# EAGLE design receevur (EAGLE 9.2.2)
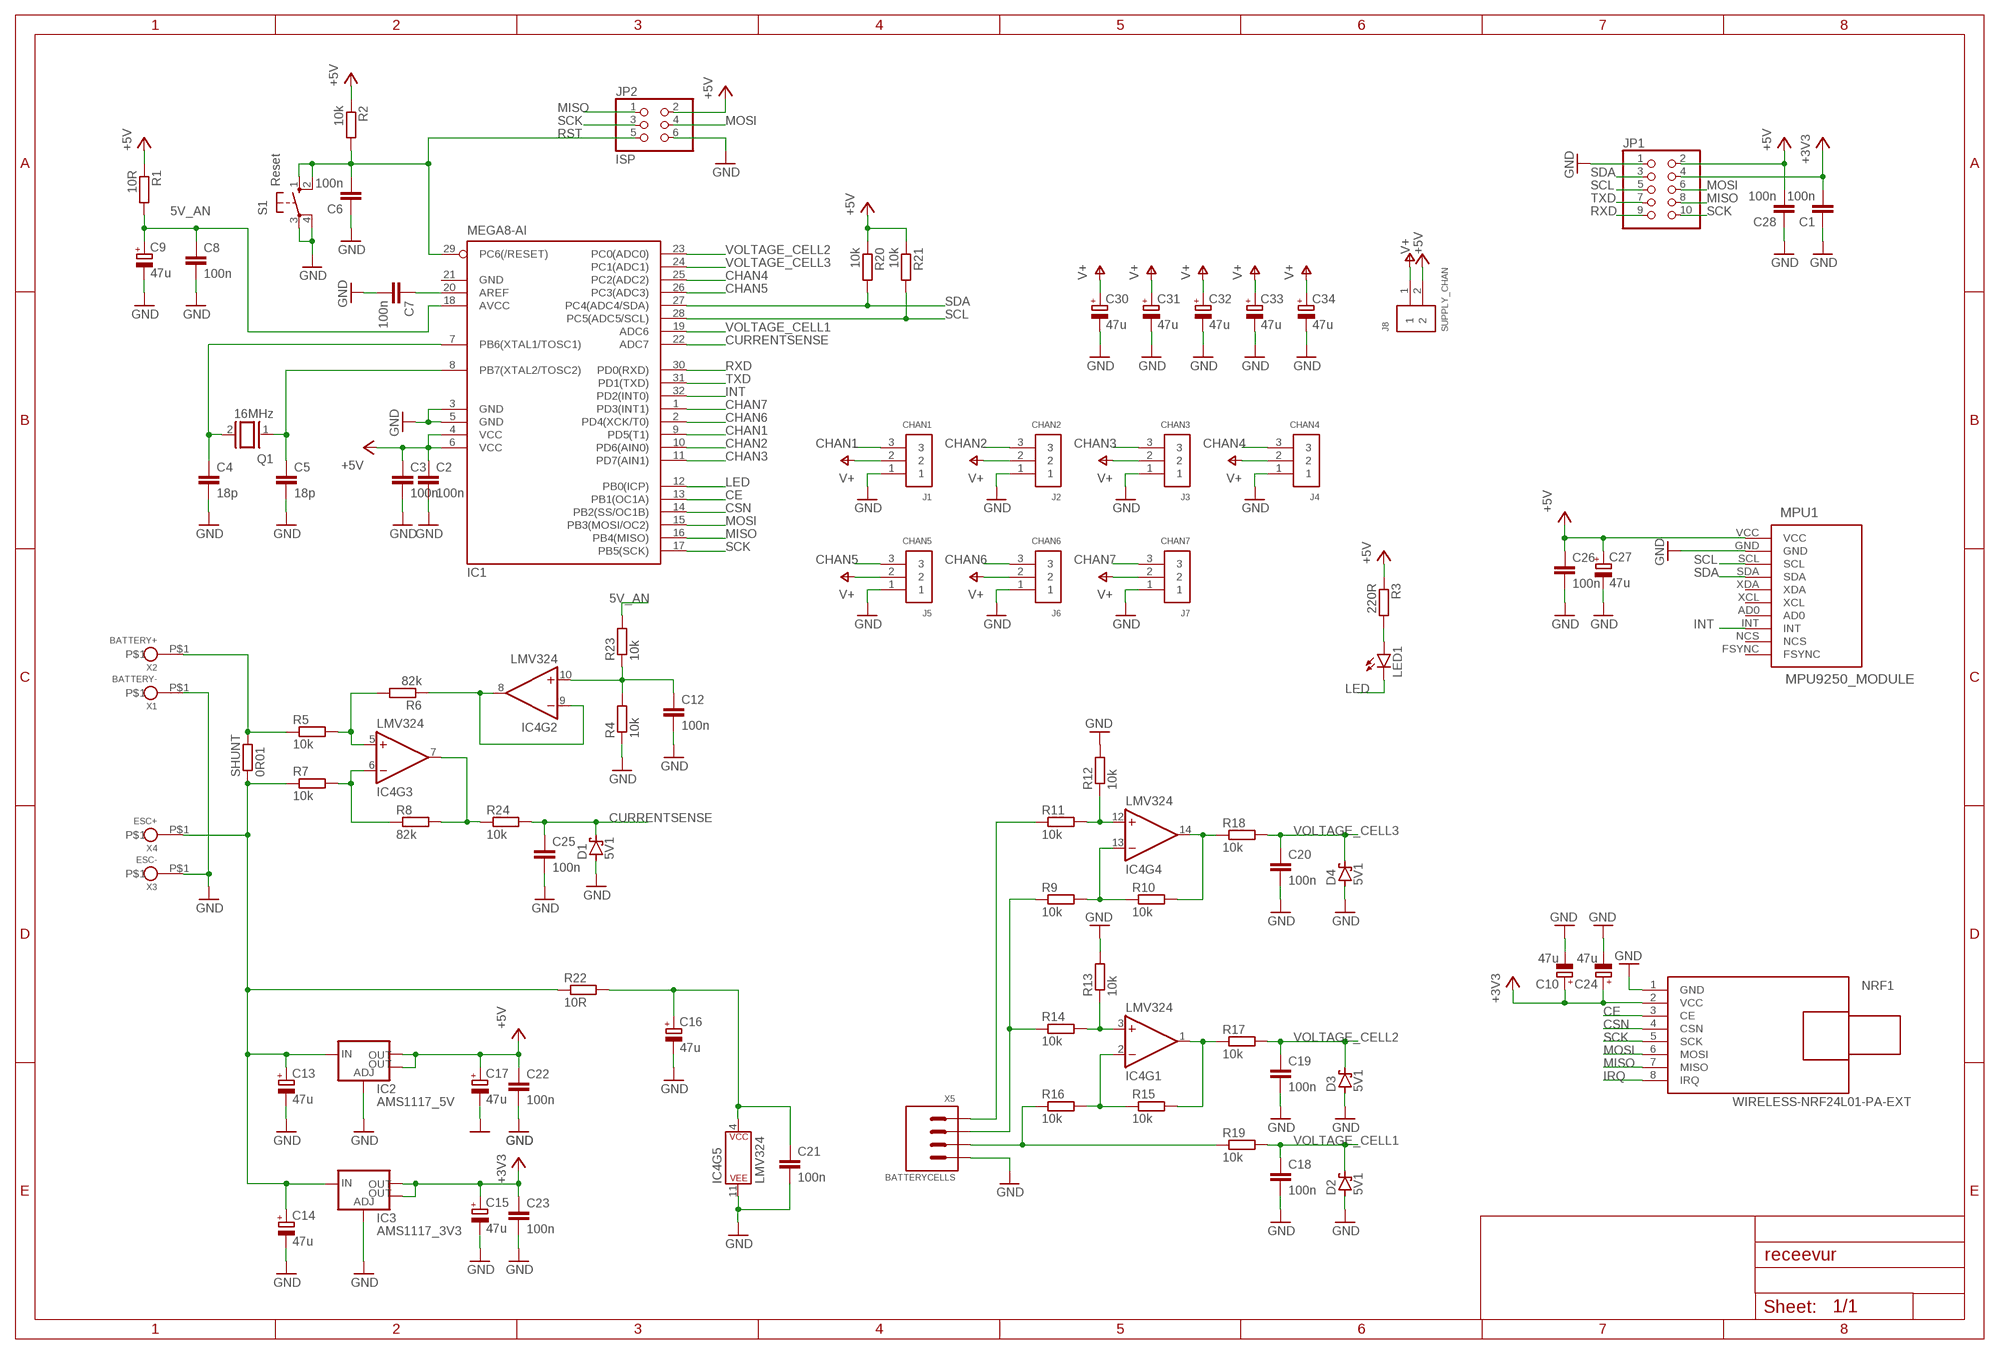
[diagram p0: schematic, sheet 1]

## Parts
C1  100n  C-EUC0805  [C0805]
C2  100n  C-EUC0805  [C0805]
C3  100n  C-EUC0805  [C0805]
C4  18p  C-EUC0805  [C0805]
C5  18p  C-EUC0805  [C0805]
C6  100n  C-EUC0805  [C0805]
C7  100n  C-EUC0805  [C0805]
C8  100n  C-EUC0805  [C0805]
C9  47u  CPOL-EU153CLV-0405  [153CLV-0405]
C10  47u  CPOL-EU153CLV-0405  [153CLV-0405]
C12  100n  C-EUC0805  [C0805]
C13  47u  CPOL-EU153CLV-0405  [153CLV-0405]
C14  47u  CPOL-EU153CLV-0405  [153CLV-0405]
C15  47u  CPOL-EU153CLV-0405  [153CLV-0405]
C16  47u  CPOL-EU153CLV-0405  [153CLV-0405]
C17  47u  CPOL-EU153CLV-0405  [153CLV-0405]
C18  100n  C-EUC0805  [C0805]
C19  100n  C-EUC0805  [C0805]
C20  100n  C-EUC0805  [C0805]
C21  100n  C-EUC0805  [C0805]
C22  100n  C-EUC0805  [C0805]
C23  100n  C-EUC0805  [C0805]
C24  47u  CPOL-EU153CLV-0405  [153CLV-0405]
C25  100n  C-EUC0805  [C0805]
C26  100n  C-EUC0805  [C0805]
C27  47u  CPOL-EU153CLV-0405  [153CLV-0405]
C28  100n  C-EUC0805  [C0805]
C30  47u  CPOL-EU153CLV-0405  [153CLV-0405]
C31  47u  CPOL-EU153CLV-0405  [153CLV-0405]
C32  47u  CPOL-EU153CLV-0405  [153CLV-0405]
C33  47u  CPOL-EU153CLV-0405  [153CLV-0405]
C34  47u  CPOL-EU153CLV-0405  [153CLV-0405]
D1  5V1  BAT60J  [SOD323_ST]
D2  5V1  BAT60J  [SOD323_ST]
D3  5V1  BAT60J  [SOD323_ST]
D4  5V1  BAT60J  [SOD323_ST]
IC1  MEGA8-AI  [TQFP32-08]
IC2  AMS1117_5V  V_REG_LM1117SOT223  [SOT223]
IC3  AMS1117_3V3  V_REG_LM1117SOT223  [SOT223]
IC4  LMV324  [SO14]
J1  CHAN1  61300311121  [61300311121]
J2  CHAN2  61300311121  [61300311121]
J3  CHAN3  61300311121  [61300311121]
J4  CHAN4  61300311121  [61300311121]
J5  CHAN5  61300311121  [61300311121]
J6  CHAN6  61300311121  [61300311121]
J7  CHAN7  61300311121  [61300311121]
J8  SUPPLY_CHAN  61300211121  [61300211121]
JP1  PINHD-2X5  [2X05]
JP2  ISP  PINHD-2X3  [2X03]
LED1  LEDCHIP-LED0805  [CHIP-LED0805]
MPU1  MPU9250_MODULE  [MPU9250_MODULE]
NRF1  WIRELESS-NRF24L01-PA-EXT  [WIRELESS-NRF24L01-PA-EXT]
Q1  16MHz  XTAL/S  [QS]
R1  10R  R-EU_R0805  [R0805]
R2  10k  R-EU_R0805  [R0805]
R3  220R  R-EU_R0805  [R0805]
R4  10k  R-EU_R0805  [R0805]
R5  10k  R-EU_R0805  [R0805]
R6  82k  R-EU_R0805  [R0805]
R7  10k  R-EU_R0805  [R0805]
R8  82k  R-EU_R0805  [R0805]
R9  10k  R-EU_R0805  [R0805]
R10  10k  R-EU_R0805  [R0805]
R11  10k  R-EU_R0805  [R0805]
R12  10k  R-EU_R0805  [R0805]
R13  10k  R-EU_R0805  [R0805]
R14  10k  R-EU_R0805  [R0805]
R15  10k  R-EU_R0805  [R0805]
R16  10k  R-EU_R0805  [R0805]
R17  10k  R-EU_R0805  [R0805]
R18  10k  R-EU_R0805  [R0805]
R19  10k  R-EU_R0805  [R0805]
R20  10k  R-EU_R0805  [R0805]
R21  10k  R-EU_R0805  [R0805]
R22  10R  R-EU_R0805  [R0805]
R23  10k  R-EU_R0805  [R0805]
R24  10k  R-EU_R0805  [R0805]
S1  Reset  10-XX  [B3F-10XX]
SHUNT  0R01  R-EU_R2512  [R2512]
X1  BATTERY-  SMDSOLDERPAD5X7MM  [SMDSOLDERPAD_5X7]
X2  BATTERY+  SMDSOLDERPAD5X7MM  [SMDSOLDERPAD_5X7]
X3  ESC-  SMDSOLDERPAD5X7MM  [SMDSOLDERPAD_5X7]
X4  ESC+  SMDSOLDERPAD5X7MM  [SMDSOLDERPAD_5X7]
X5  BATTERYCELLS  CELLJACK  [CELLJACK]

## Nets
5V_AN: C8.1 C9.+ IC1.18(AVCC) R1.2 R23.2
+3V3: C1.2 C10.+ C15.+ C23.1 C24.+ IC3.2(OUT) IC3.4(OUT) JP1.4 NRF1.2(VCC)
+5V: C2.1 C3.1 C17.+ C22.1 C26.1 C27.+ C28.2 IC1.4(VCC) IC1.6(VCC) IC2.2(OUT) IC2.4(OUT) J8.2 JP1.2 JP2.2 MPU1.VCC R1.1 R2.1 R3.1 R20.1 R21.1
CE: IC1.13(PB1(OC1A)) NRF1.3(CE)
CHAN1: IC1.9(PD5(T1)) J1.3
CHAN2: IC1.10(PD6(AIN0)) J2.3
CHAN3: IC1.11(PD7(AIN1)) J3.3
CHAN4: IC1.25(PC2(ADC2)) J4.3
CHAN5: IC1.26(PC3(ADC3)) J5.3
CHAN6: IC1.2(PD4(XCK/T0)) J6.3
CHAN7: IC1.1(PD3(INT1)) J7.3
CSN: IC1.14(PB2(SS/OC1B)) NRF1.4(CSN)
CURRENTSENSE: C25.1 D1.C IC1.22(ADC7) R24.2
GND: C1.1 C2.2 C3.2 C4.2 C5.2 C6.1 C7.2 C8.2 C9.- C10.- C12.2 C13.- C14.- C15.- C16.- C17.- C18.2 C19.2 C20.2 C21.2 C22.2 C23.2 C24.- C25.2 C26.2 C27.- C28.1 C30.- C31.- C32.- C33.- C34.- D1.A D2.A D3.A D4.A IC1.3(GND) IC1.5(GND) IC2.1(ADJ) IC3.1(ADJ) IC4.11(P$V-) J1.1 J2.1 J3.1 J4.1 J5.1 J6.1 J7.1 JP1.1 JP2.6 MPU1.GND NRF1.1(GND) R4.1 R12.2 R13.2 S1.3(P) S1.4(P1) X1.P$1 X3.P$1 X5.P$1
INT: IC1.32(PD2(INT0)) MPU1.INT
IRQ: NRF1.8(IRQ)
LED: IC1.12(PB0(ICP)) LED1.C
MISO: IC1.16(PB4(MISO)) JP1.8 JP2.1 NRF1.7(MISO)
MOSI: IC1.15(PB3(MOSI/OC2)) JP1.6 JP2.4 NRF1.6(MOSI)
N$1: C4.1 IC1.7(PB6(XTAL1/TOSC1)) Q1.2
N$2: C5.1 IC1.8(PB7(XTAL2/TOSC2)) Q1.1
N$3: C7.1 IC1.20(AREF)
N$4: LED1.A R3.2
N$5: C13.+ C14.+ IC2.3(IN) IC3.3(IN) R7.1 R22.1 SHUNT.1 X4.P$1
N$6: IC4.12(+IN) R11.2 R12.1
N$7: C16.+ C21.1 IC4.4(P$V+) R22.2
N$8: R5.1 SHUNT.2 X2.P$1
N$9: IC4.13(-IN) R9.2 R10.1
N$10: IC4.8(OUT) IC4.9(-IN) R6.1
N$12: IC4.6(-IN) R7.2 R8.1
N$18: IC4.14(OUT) R10.2 R18.1
N$19: IC4.3(+IN) R13.1 R14.2
N$20: IC4.2(-IN) R15.1 R16.2
N$21: IC4.1(OUT) R15.2 R17.1
N$22: R11.1 X5.P$4
N$23: R9.1 R14.1 X5.P$3
N$24: R16.1 R19.1 X5.P$2
N$32: C12.1 IC4.10(+IN) R4.2 R23.1
N$33: IC4.5(+IN) R5.2 R6.2
N$$$: IC4.7(OUT) R8.2 R24.1
RST: C6.2 IC1.29(PC6(/RESET)) JP2.5 R2.2 S1.1(S) S1.2(S1)
RXD: IC1.30(PD0(RXD)) JP1.9
SCK: IC1.17(PB5(SCK)) JP1.10 JP2.3 NRF1.5(SCK)
SCL: IC1.28(PC5(ADC5/SCL)) JP1.5 MPU1.SCL R21.2
SDA: IC1.27(PC4(ADC4/SDA)) JP1.3 MPU1.SDA R20.2
TXD: IC1.31(PD1(TXD)) JP1.7
V+: C30.+ C31.+ C32.+ C33.+ C34.+ J1.2 J2.2 J3.2 J4.2 J5.2 J6.2 J7.2 J8.1
VOLTAGE_CELL1: C18.1 D2.C IC1.19(ADC6) R19.2
VOLTAGE_CELL2: C19.1 D3.C IC1.23(PC0(ADC0)) R17.2
VOLTAGE_CELL3: C20.1 D4.C IC1.24(PC1(ADC1)) R18.2
Unconnected: MPU1.AD0 MPU1.FSYNC MPU1.NCS MPU1.XCL MPU1.XDA

## Power pins joined to a net without a drawn wire
GND: IC1.21(GND)

## Library data of the parts
C1-C8 C12 C18-C23 C25 C26 C28 = rcl:C-EU: CAPACITOR, European symbol; SPICEPREFIX: C
C9 C10 C13-C17 C24 C27 C30-C34 = rcl:CPOL-EU: POLARIZED CAPACITOR, European symbol; SPICEPREFIX: C
D1-D4 = diode:BAT60J: Schottky barrier diode Source: www.st.com, BAT60J.pdf
IC1 = atmel:MEGA8: MICROCONTROLLER 8 Kbytes FLASH, 1 kbytes SRAM, 512 bytes EEPROM, USART, 6-channel 10 bit ADC, 2-channel 8 bit ADC Pin compatible with Atmega48, ATMega88, ATMega168 Source: avr.lbr; MPN: ATMEGA8-16AU; OC_FARNELL: 9171371; OC_NEWARK: 73M8863
IC2 IC3 = SparkFun-IC-Power:V_REG_LM1117: Voltage Regulator LM1117 Standard adjustable voltage regulator but in SMD form. Spark Fun Electronics SKU : COM-00595; PROD_ID: VREG-08170
IC4 = SparkFun-IC-Amplifiers:LMV324: IC LMV324 Quad Op Amp Jellybean quad op-amp Datasheet <http://cdn.sparkfun.com/datasheets/Sensors/Sound/LMV324.pdf> SparkFun Products SparkFun Sensor Kit <https://www.sparkfun.com/products/13754> (DEV-13754) SparkFun Inventor's Kit for Arduino 101 <https://www.sparkfun.com/products/13844> (KIT-13844) SparkFun Sound Detector <https://www.sparkfun.com/products/12642> (SEN-12642); PROD_ID: IC-08227
J1-J7 = Headers:61300311121: CONN HEADER VERT 3POS 2.54MM Manufacturer's datasheet <https://katalog.we-online.de/em/datasheet/6130xx11121.pdf>; CREATED_BY: PCBLayout.com; DIGI_KEY_PART_NUMBER: 732-5316-ND; MANUFACTURER: Wurth Electronics Inc.; MPN: 61300311121
J8 = Headers:61300211121: CONN HEADER VERT 2POS 2.54MM Manufacturer's datasheet <https://katalog.we-online.de/em/datasheet/6130xx11121.pdf>; CREATED_BY: PCBLayout.com; DIGI_KEY_PART_NUMBER: 732-5315-ND; MANUFACTURER: Wurth Electronics Inc.; MPN: 61300211121
JP1 = pinhead:PINHD-2X5: PIN HEADER
JP2 = pinhead:PINHD-2X3: PIN HEADER
LED1 = led:LED: LED OSRAM: - CHIPLED LG R971, LG N971, LY N971, LG Q971, LY Q971, LO R971, LY R971 LH N974, LH R974 LS Q976, LO Q976, LY Q976 LO Q996 - Hyper CHIPLED LW Q18S LB Q993, LB Q99A, LB R99A - SideLED LS A670, LO A670, LY A670, LG A670, LP A670 LB A673, LV A673, LT A673, LW A673 LH A674 LY A675 LS A676, LA A676, LO A676, LY A676, LW A676 LS A679, LY A679, LG A679 - Hyper Micro SIDELED® LS Y876, LA Y876, LO Y876, LY Y876 LT Y87S - SmartLED LW L88C, LW L88S LB L89C, LB L89S, LG L890 LS L89K, LO L89K, LY L89K LS L896, LA L896, LO L896, LY L896 - TOPLED LS T670, LO T670, LY T670, LG T670, LP T670 LSG T670, LSP T670, LSY T670, LOP T670, LYG T670 LG T671, LOG T671, LSG T671 LB T673, LV T673, LT T673, LW T673 LH T674 LS T676, LA T676, LO T676, LY T676, LB T676, LH T676, LSB T676, LW T676 LB T67C, LV T67C, LT T67C, LS T67K, LO T67K, LY T67K, LW E67C LS E67B, LA E67B, LO E67B, LY E67B, LB E67C, LV E67C, LT E67C LW T67C LS T679, LY T679, LG T679 LS T770, LO T770, LY T770, LG T770, LP T770 LB T773, LV T773, LT T773, LW T773 LH T774 LS E675, LA E675, LY E675, LS T675 LS T776, LA T776, LO T776, LY T776, LB T776 LHGB T686 LT T68C, LB T68C - Hyper Mini TOPLED® LB M676 - Mini TOPLED Santana® LG M470 LS M47K, LO M47K, LY M47K Source: http://www.osram.convergy.de LUXEON: - LUMILED® LXK2-PW12-R00, LXK2-PW12-S00, LXK2-PW14-U00, LXK2-PW14-V00 LXK2-PM12-R00, LXK2-PM12-S00, LXK2-PM14-U00 LXK2-PE12-Q00, LXK2-PE12-R00, LXK2-PE12-S00, LXK2-PE14-T00, LXK2-PE14-U00 LXK2-PB12-K00, LXK2-PB12-L00, LXK2-PB12-M00, LXK2-PB14-N00, LXK2-PB14-P00, LXK2-PB14-Q00 LXK2-PR12-L00, LXK2-PR12-M00, LXK2-PR14-Q00, LXK2-PR14-R00 LXK2-PD12-Q00, LXK2-PD12-R00, LXK2-PD12-S00 LXK2-PH12-R00, LXK2-PH12-S00 LXK2-PL12-P00, LXK2-PL12-Q00, LXK2-PL12-R00 Source: www.luxeon.com KINGBRIGHT: KA-3528ASYC Source: www.kingbright.com
MPU1 = flightcontroller:MPU9250_MODULE
NRF1 = diy-modules:WIRELESS-NRF24L01-PA-EXT: 2.4 GHz Wireless Module based on NRF24L01 chip with preamplifier and external antenna Click here to find device on ebay.com <http://www.ebay.com/sch/nrf24l01+pa+lna+sma>
Q1 = special:XTAL/S: CRYSTAL
R1-R24 SHUNT = rcl:R-EU_: RESISTOR, European symbol; SPICEPREFIX: R
S1 = switch-omron:10-XX: OMRON SWITCH; MPN: B3F-1000; OC_FARNELL: 176432; OC_NEWARK: 36M3542
X1-X4 = flightcontroller:SMDSOLDERPAD: smd solderpads, various sizes
X5 = flightcontroller:CELLJACK: battery cell monitoring jack

## Board
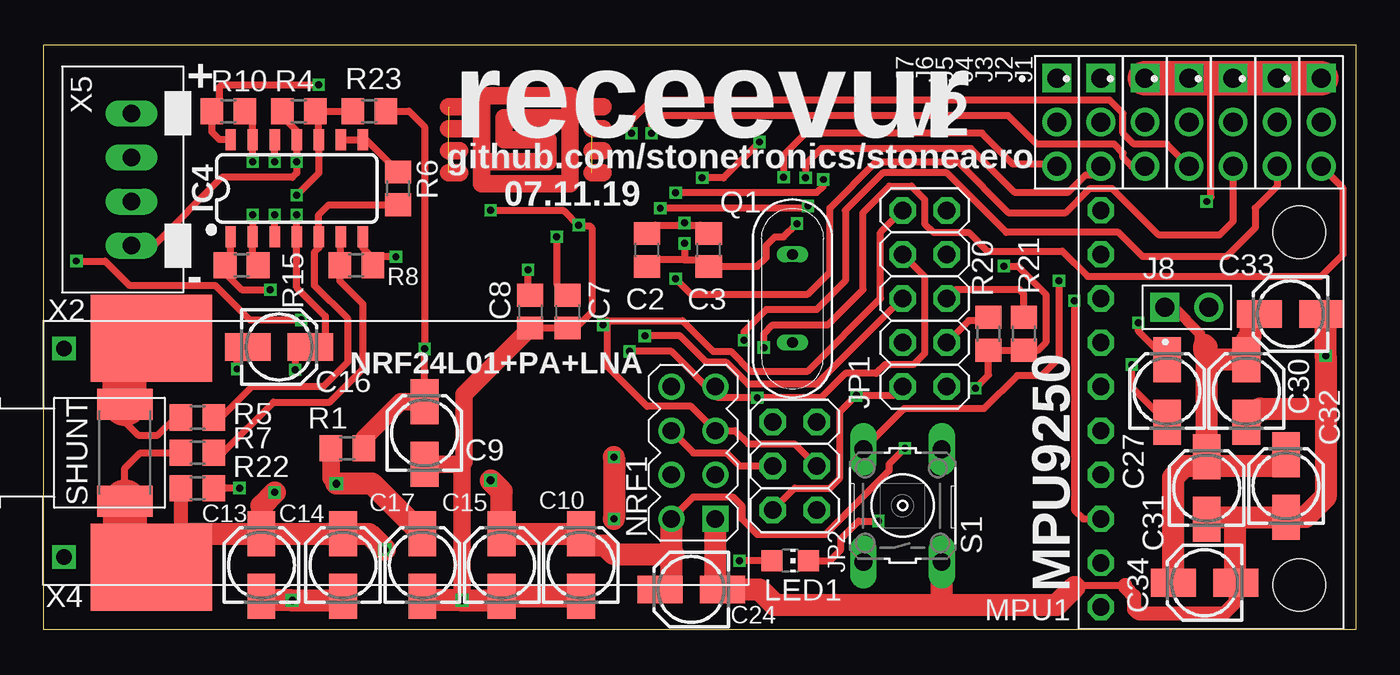
[diagram p1: board, top side]
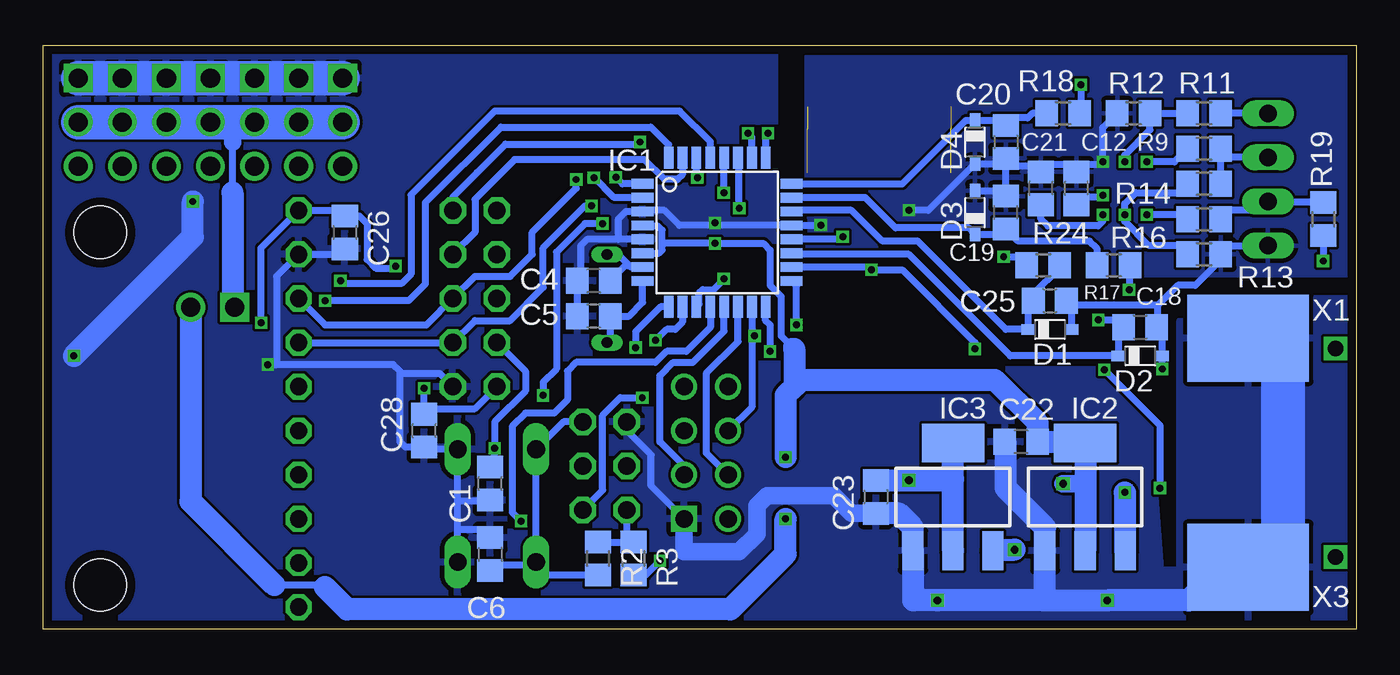
[diagram p2: board, bottom side, seen from below]

Size 75.67 x 33.65 mm. Coordinates in mm from the lower left corner, seen from the top.
Outline: 0,0 75.67,0 75.67,33.65 0,33.65 0,0
Copper layers (1*16): Top 0.035mm / dielectric 1.6mm / Bottom 0.035mm
Design rules "Elecrow_2-layer_PCB_eagle_rule": minimum track width 6mil, minimum drill 12mil, track to track 6mil, track to pad 6mil, pad to pad 6mil, via to via 8mil, smd to smd 0mil, copper to edge 20mil, drill to drill 10mil, minimum pad ring 6mil, minimum via ring 6mil, stop-mask expansion 0mil, vias tented up to drill 100mil, thermal gap 10mil

### Footprints (pad centres in the part's own frame; a part is rotated, then mirrored left to right if it is on the bottom)
C0805 = smd 1.3 x 1.5: 1 -0.95,0; 2 0.95,0
153CLV-0405 = smd 2.6 x 1.6: + 1.8,0; - -1.8,0
SOD323_ST = smd 0.8 x 0.6: A 1.25,0; C -1.25,0
TQFP32-08 = smd 1.27 x 0.559: 1 -4.293,2.8; 2 -4.293,2; 3 -4.293,1.2; 4 -4.293,0.4; 5 -4.293,-0.4; 6 -4.293,-1.2; 7 -4.293,-2; 8 -4.293,-2.8; 17 4.293,-2.8; 18 4.293,-2; 19 4.293,-1.2; 20 4.293,-0.4; 21 4.293,0.4; 22 4.293,1.2; 23 4.293,2; 24 4.293,2.8 | smd 0.559 x 1.27: 9 -2.8,-4.293; 10 -2,-4.293; 11 -1.2,-4.293; 12 -0.4,-4.293; 13 0.4,-4.293; 14 1.2,-4.293; 15 2,-4.293; 16 2.8,-4.293; 25 2.8,4.293; 26 2,4.293; 27 1.2,4.293; 28 0.4,4.293; 29 -0.4,4.293; 30 -1.2,4.293; 31 -2,4.293; 32 -2.8,4.293
SOT223 = smd 1.219 x 2.235: 1 -2.311,-3.099; 2 0,-3.099; 3 2.311,-3.099 | smd 3.6 x 2.2: 4 0,3.099
SO14 = smd 0.6 x 1.2: 1 -3.175,-2.8; 2 -1.905,-2.8; 3 -0.635,-2.8; 4 0.635,-2.8; 5 1.905,-2.8; 6 3.175,-2.8; 7 4.445,-2.8; 8 4.445,2.8; 9 3.175,2.8; 10 1.905,2.8; 11 0.635,2.8; 12 -0.635,2.8; 13 -1.905,2.8; 14 -3.175,2.8
61300311121 = drill 1.1 square: 1 -2.54,0 | drill 1.1: 2 0,0; 3 2.54,0
61300211121 = drill 1.1 square: 1 -1.27,0 | drill 1.1: 2 1.27,0
2X05 = drill 1.016 octagon: 1 -5.08,-1.27; 2 -5.08,1.27; 3 -2.54,-1.27; 4 -2.54,1.27; 5 0,-1.27; 6 0,1.27; 7 2.54,-1.27; 8 2.54,1.27; 9 5.08,-1.27; 10 5.08,1.27
2X03 = drill 1.016 octagon: 1 -2.54,-1.27; 2 -2.54,1.27; 3 0,-1.27; 4 0,1.27; 5 2.54,-1.27; 6 2.54,1.27
CHIP-LED0805 = smd 1.2 x 1.2: A 0,-1.05; C 0,1.05
MPU9250_MODULE = drill 1 octagon: AD0 0,-3.81; FSYNC 0,-11.43; GND 0,8.89; INT 0,-6.35; NCS 0,-8.89; SCL 0,6.35; SDA 0,3.81; VCC 0,11.43; XCL 0,-1.27; XDA 0,1.27 | hole 3: 11.43,10.16; 11.43,-10.16
WIRELESS-NRF24L01-PA-EXT = drill 1 square: 1 -18.415,3.81 | drill 1: 2 -15.875,3.81; 3 -18.415,1.27; 4 -15.875,1.27; 5 -18.415,-1.27; 6 -15.875,-1.27; 7 -18.415,-3.81; 8 -15.875,-3.81 | drill 0.9 square: P$1 19.125,6; P$2 19.125,-6
QS = drill 0.61 long: 1 -2.54,0; 2 2.54,0
R0805 = smd 1.3 x 1.5: 1 -0.95,0; 2 0.95,0
B3F-10XX = drill 1.016 long: 1 -3.251,2.261; 2 3.251,2.261; 3 -3.251,-2.261; 4 3.251,-2.261
R2512 = smd 1.8 x 3.2: 1 -2.8,0; 2 2.8,0
SMDSOLDERPAD_5X7 = smd 5 x 7: P$1 0,0
CELLJACK = drill 1 long: P$1 0,-3.81; P$2 0,-1.27; P$3 0,1.27; P$4 0,3.81

### Placement (x,y rotation side)
C1  49.91,8.38 90 bottom
C2  34.8,21.84 90 top
C3  38.35,21.84 90 top
C4  43.94,20.07 180 bottom
C5  43.94,18.03 180 bottom
C6  49.91,4.32 270 bottom
C7  30.23,18.29 270 top
C8  28.07,18.29 270 top
C9  21.97,11.3 90 top
C10  30.99,3.68 90 top
C12  16.13,25.4 90 bottom
C13  12.57,3.68 90 top
C14  17.27,3.68 90 top
C15  26.42,3.68 90 top
C16  13.59,16.26 0 top
C17  21.84,3.68 90 top
C18  12.45,17.4 0 bottom
C19  20.19,24 90 bottom
C20  20.19,28.07 270 bottom
C21  18.16,25.4 90 bottom
C22  19.3,10.79 180 bottom
C23  27.69,7.62 270 bottom
C24  37.34,2.29 180 top
C25  17.65,18.92 0 bottom
C26  58.29,22.86 270 bottom
C27  64.77,13.72 90 top
C28  53.72,11.43 90 bottom
C30  69.34,13.72 90 top
C31  67.06,8.13 90 top
C32  71.63,8.26 90 top
C33  71.88,18.16 180 top
C34  66.93,2.67 180 top
D1  17.65,17.27 0 bottom
D2  12.45,15.75 0 bottom
D3  21.97,24 90 bottom
D4  21.97,28.07 270 bottom
IC1  36.83,22.86 0 bottom
IC2  15.62,7.62 0 bottom
IC3  23.24,7.62 0 bottom
IC4  13.97,25.4 0 top
J1  73.66,29.21 270 top
J2  71.12,29.21 270 top
J3  68.58,29.21 270 top
J4  66.04,29.21 270 top
J5  63.5,29.21 270 top
J6  60.96,29.21 270 top
J7  58.42,29.21 270 top
J8  65.91,18.54 0 top
JP1  50.8,19.05 90 top
JP2  43.31,9.4 90 top
LED1  43.05,3.94 270 top
MPU1  60.96,12.7 0 top
NRF1  20.32,10.16 180 top
Q1  43.18,19.05 90 top
R1  17.53,10.41 0 top
R2  43.69,4.06 270 bottom
R3  41.66,4.06 270 bottom
R4  14.73,29.84 0 top
R5  8.89,12.19 0 top
R6  20.45,25.4 270 top
R7  8.89,10.16 0 top
R8  18.03,20.95 0 top
R9  8.76,27.69 180 bottom
R10  10.67,29.84 180 top
R11  8.76,29.72 180 bottom
R12  12.83,29.72 180 bottom
R13  8.76,21.59 0 bottom
R14  8.76,25.65 180 bottom
R15  11.43,20.95 180 top
R16  8.76,23.62 180 bottom
R17  13.97,20.95 180 bottom
R18  16.89,29.72 180 bottom
R19  1.91,23.62 270 bottom
R20  54.48,17.02 90 top
R21  56.52,17.02 90 top
R22  8.89,8.13 0 top
R23  18.8,29.84 0 top
R24  18.03,20.95 0 bottom
S1  49.53,7.11 90 top
SHUNT  4.7,10.16 90 top
X1  6.22,16.76 270 bottom
X2  6.22,16.76 90 top
X3  6.22,3.56 270 bottom
X4  6.22,3.56 90 top
X5  5.08,25.91 0 top

### Tracks (layer width: path | path; a pad name or v marks a point on that pad's centre or on a via)
5V_AN  (via drill 0.4)
  Top 0.406: R23.2 21.08,29.84 21.97,28.96 v21.97,16.14 C9.+ | C8.1 27.94,19.36 v27.94,20.7
  Top 1.016: R1.2 18.48,10.98 20.6,13.1 C9.+
  Bottom 0.406: IC1.18 27.94,20.86 v27.94,20.7 26.16,20.7 21.97,16.51 v21.97,16.14
+3V3  (via drill 0.4, 0.45)
  Top 0.406: NRF1.2 37.47,7.62 39.75,7.62 40.26,7.11 40.26,6.35 41.15,5.46 45.09,5.46 48.77,9.14 48.77,9.53 v49.66,10.41
  Top 1.016: NRF1.2 36.3,6.25 36.3,4.32 36.3,2.41 36.17,2.29 C24.+
  Top 1.27: v25.78,8.57 26.42,7.93 C15.+ C10.+ 31.64,4.83 32.38,4.83 32.89,4.32 36.3,4.32 | C24.+ 36.2,2.94 NRF1.2
  Bottom 0.406: JP1.4 47.88,14.86 47.88,13.72 49.66,11.94 v49.66,10.41 49.66,9.59 C1.2
  Bottom 1.27: IC3.2 23.24,8.64 | 23.24,8.64 IC3.4 | C23.1 v25.78,8.57 23.31,8.57 23.24,8.64
+5V  (via drill 0.4, 0.45)
  Top 0.406: JP2.2 43.31,8.13 45.34,8.13 45.91,8.7 45.91,12.51 v46.86,13.46 49.02,13.46 JP1.2 | v53.72,13.88 54.48,14.64 R20.1 R21.1 57.34,16.07 57.78,16.51 57.78,19.3 56.17,20.92 v55.37,20.92 | v43.43,23.37 42.67,22.61 42.16,22.61 41.66,22.1 41.66,21.4 41.15,20.89 C3.1 37.97,21.27 36.96,21.27 | C27.+ 63.12,17.17 v63.12,17.65 | C2.1 34.99,20.89 35.37,21.27 36.96,21.27 | v36.96,22.23 36.96,21.27
  Top 1.016: R1.1 16.58,8.7 v16.89,8.38
  Top 1.27: C17.+ 18.95,8.38 v16.89,8.38 | v32.89,9.91 v32.89,6.35
  Bottom 0.406: IC1.4 41.1,23.24 40.26,23.24 40.01,22.99 40.01,22.1 | 40.01,22.1 40.01,21.84 40.19,21.66 IC1.6 | R2.1 R3.1 42.04,5.39 JP2.2 | JP1.2 50.8,12.7 53.4,12.7 C28.2 v53.72,13.88 | 40.01,22.1 39.88,22.23 v36.96,22.23 34.16,22.23 33.78,21.84 33.78,19.81 33.15,19.18 33.15,16.89 32.51,16.26 | v43.43,23.37 44.45,23.37 46.1,21.72 46.1,14.99 46.86,14.22 v46.86,13.46 | v55.37,20.92 55.5,20.79 56.52,20.79 57.02,21.3 57.02,23.37 57.47,23.81 C26.1 58.61,24.13 MPU1.VCC 63.12,21.97 v63.12,17.65 | 59.44,2.41 59.56,2.54 62.36,2.54
  Bottom 1.016: 32.51,16.26 32.38,16.13 | v16.89,8.38 15.75,8.38 15.62,8.26
  Bottom 1.27: IC2.2 15.62,8.26 IC2.4 15.7,10.79 C22.1 18.35,11.88 20.83,14.35 32,14.35 32.38,13.97 | v32.89,6.35 32.89,4.32 36.07,1.14 58.17,1.14 59.44,2.41 | 62.36,2.54 67.18,7.37 J8.2 | 32.38,16.13 32.38,13.97 | v32.89,9.91 32.89,13.46 32.38,13.97
CE
  Bottom 0.406: IC1.13 36.43,17.16 38.23,15.37 39.37,15.37 40.13,14.61 40.13,10.79 38.73,9.4 NRF1.3
CHAN1  (via drill 0.4)
  Top 0.406: v41.53,16.22 41.53,17.02 42.04,17.53 45.21,17.53 47.24,19.56 47.24,24 48.77,25.53 50.04,25.53 50.8,24.77 50.8,23.37 51.31,22.86 53.34,22.86 54.42,21.78 58.74,21.78 60.2,20.32 73.66,20.32 74.93,21.59 74.93,25.4 J1.3
  Bottom 0.406: IC1.9 40.11,18.57 41.53,17.14 v41.53,16.22
CHAN2  (via drill 0.4)
  Top 0.406: J2.3 71.12,25.53 69.85,24.26 69.85,23.11 68.2,21.46 63.37,21.46 61.98,22.86 55.5,22.86 52.07,26.29 48.39,26.29 46.23,24.13 46.23,20.07 44.58,18.41 41.66,18.41 40.39,17.14 v40.39,16.64
  Bottom 0.406: v40.39,16.64 39.75,17.27 39.24,17.27 38.83,17.68 IC1.10
CHAN3  (via drill 0.4)
  Top 0.406: v36.45,20.19 37.34,19.3 44.07,19.3 45.34,20.57 45.34,24.26 48.01,26.92 52.7,26.92 55.63,24 58.93,24 60.33,25.4 61.59,25.4 64.26,22.73 67.82,22.73 68.58,23.5 J3.3
  Bottom 0.406: v36.45,20.19 36.45,20.15 37.04,19.56 37.66,19.56 37.87,19.35 37.87,18.73 IC1.11
CHAN4  (via drill 0.4)
  Top 0.406: J4.3 64.77,27.94 62.87,27.94 62.23,28.57 62.23,29.72 61.47,30.48 35.05,30.48 33.78,29.21 33.78,28.7 v33.91,28.57
  Bottom 0.406: IC1.25 34.03,28.45 v33.91,28.57
CHAN5  (via drill 0.4)
  Top 0.406: J5.3 62.74,26.67 62.23,27.18 62.23,27.43 61.72,27.94 57.28,27.94 55.63,29.59 35.56,29.59 35.05,29.08 v35.05,28.57
  Bottom 0.406: IC1.26 34.83,28.35 v35.05,28.57
CHAN6  (via drill 0.4)
  Top 0.406: J6.3 60.45,26.16 60.07,26.16 59.05,25.15 56.01,25.15 53.47,27.69 44.83,27.69 43.94,26.8 v43.94,26
  Bottom 0.406: IC1.2 42.77,24.86 43.94,26.04 v43.94,26
CHAN7  (via drill 0.4)
  Top 0.406: J7.3 58.29,26.8 55.88,26.8 54.1,28.57 43.94,28.57 42.67,27.3 v42.67,26.04
  Bottom 0.406: IC1.1 42.3,25.66 v42.67,26.04
CSN
  Bottom 0.406: NRF1.4 37.47,10.16 37.47,14.73 35.63,16.57 IC1.14
CURRENTSENSE
  Bottom 0.406: R24.2 17.08,20.83 18.6,19.31 C25.1 18.9,18.62 D1.C 20.19,17.27 25.27,22.35 27.3,22.35 29.08,24.13 32.47,24.13 IC1.22
GND  (via drill 0.4, 0.45)
  Top 0.406: X5.P$1 6.35,22.1 10.29,26.04 14.35,26.04 14.61,26.29 v14.61,26.92 IC4.11 14.61,28.7 13.78,29.52 R4.1 | C16.- 11.66,16.13 11.18,16.13 v11.18,14.99 | v30.86,23.28 30.9,23.24 | 30.9,23.24 31.5,23.24 31.62,23.11 31.62,18.29 30.67,17.34 C7.2 C8.2 | C27.- 62.74,13.95 v62.74,15.24 | 59.44,2.41 59.56,2.54 62.36,2.54 | v67.06,24.64 67.31,24.89 67.31,31.75 | v25.78,24.13 29.97,24.13 30.86,23.24 30.9,23.24 | 37.08,23.28 v36.96,23.41 | 37.08,23.28 35.28,23.28 C2.2 | 37.08,23.28 37.87,23.28 C3.2
  Top 0.813: 62.36,2.54 62.36,2.41 62.87,1.91 62.87,1.14 63.09,0.91 68.07,0.91 68.73,1.57 C34.-
  Top 1.016: 24.13,9.53 v24.13,1.65 | C8.2 24.26,13.53 24.26,9.65 24.13,9.53 | C9.- 24.11,9.5 24.13,9.53
  Top 1.27: C13.- 12.8,1.65 v14.35,1.65 17.04,1.65 C14.- | C17.- 22.08,1.65 v24.13,1.65 26.18,1.65 C15.- C10.- | 51.79,1.4 S1.3 | 51.79,1.4 58.42,1.4 59.44,2.41 | C33.- 73.91,17.93 v73.91,15.75 73.91,12.7 | C31.- 67.18,6.46 68.71,6.46 | 68.71,6.46 C32.- 72.75,6.46 73.91,7.62 73.91,12.7 | C30.- 70.13,12.7 73.91,12.7 | C34.- 68.71,2.67 68.71,6.46 | NRF1.1 38.73,2.69 C24.- 41.27,2.29 42.16,1.4 51.79,1.4
  Top 2: J1.1 67.31,31.75 J5.1
  Bottom 0.406: X5.P$1 7.3,22.1 R13.2 7.81,21.27 9.27,19.81 10.29,19.81 11.43,18.67 | 16.51,26.8 17.71,26.8 C21.2 18.16,26.67 20.19,26.67 | 16.51,26.8 14.73,26.8 v14.61,26.92 14.61,28.89 R12.2 | C12.2 16.51,26.73 16.51,26.8 | C19.2 20.19,25.4 | 20.19,25.4 20.19,26.67 | 20.19,26.67 C20.2 20.49,26.82 D4.A 24.66,24.13 v25.78,24.13 | D3.A 20.34,25.25 20.19,25.4 | 16.4,18.67 16.4,18.92 C25.2 | 16.4,18.67 D1.A | v11.18,14.99 11.2,15.01 D2.A 11.2,17.1 C18.2 11.43,17.46 11.43,18.67 | 11.43,18.67 16.4,18.67 | C5.2 C4.2 44.7,20.25 44.7,22.1 44.34,22.46 42.55,22.46 | IC1.5 42.55,22.46 | 42.55,22.46 42.55,23.62 42.11,24.06 IC1.3 41.05,24.13 39.88,24.13 39.01,23.26 36.83,23.26 | NRF1.1 40.64,8.26 40.64,10.03 42.04,11.43 JP2.6 | S1.3 51.79,5.71 | 51.79,5.71 51.79,7.37 | 51.79,7.37 S1.4 53.6,10.36 C28.1 54.8,10.48 55.12,10.79 55.12,14.86 | C6.1 49.91,5.33 50.29,5.71 51.79,5.71 | C1.1 49.98,7.37 51.79,7.37 | 55.12,14.86 54.99,14.73 52.83,14.73 JP1.1 | v30.86,23.28 30.88,23.26 IC1.21 36.83,23.26 | 62.23,15.24 62.23,20.32 MPU1.GND 58.61,21.59 C26.2 | 55.12,14.86 55.5,15.24 62.23,15.24 | v62.74,15.24 62.23,15.24 | 36.83,23.26 36.96,23.39 v36.96,23.41
  Bottom 1.016: NRF1.1 38.73,4.45 35.56,4.45 34.54,5.46 34.54,7.11 33.97,7.69 30.1,7.69 29.08,6.67 C23.2
  Bottom 1.27: X3.P$1 7.75,3.56 9.65,1.65 v14.35,1.65 18.03,1.65 | 18.03,1.65 17.93,1.75 IC2.1 17.93,5.87 20.19,8.13 20.19,10.73 C22.2 | 18.03,1.65 v24.13,1.65 25.53,1.65 25.53,4.5 IC3.1 25.55,5.87 26.36,6.67 C23.2 | v73.91,15.75 67.06,22.61 v67.06,24.64
  Bottom 2: J1.1 J2.1 J3.1 J4.1 J5.1 J6.1 J7.1
  Bottom 2.54: X3.P$1 4.19,5.59 4.19,16.51 5.97,16.51 X1.P$1
  pour Bottom: 10.16,0 10.16,17.78 8.89,19.05 0,19.05 0,0
  pour Bottom: 10.16,0 75.69,0 75.69,33.78 33.53,33.78 33.53,21.84 26.67,14.99 12.16,14.99 11.27,3.43 10.16,3.43
  pour Bottom: 0,20.32 31.75,20.32 31.75,33.02 0,33.02
INT  (via drill 0.4)
  Top 0.406: v59.44,18.92 59.44,6.86 59.94,6.35 MPU1.INT
  Bottom 0.406: IC1.32 39.63,27.91 40.65,28.93 49.3,28.93 53.66,24.57 53.66,19.88 54.61,18.92 v59.44,18.92
LED  (via drill 0.4)
  Top 0.406: LED1.C 45.34,3.94 45.97,4.57 45.97,5.21 46.99,6.22 v48.13,6.22
  Bottom 0.406: v48.13,6.22 48.64,6.73 48.64,11.68 47.88,12.45 46.23,12.45 45.47,13.21 45.47,14.86 44.96,15.37 40.39,15.37 39.75,16 38.61,16 37.23,17.38 IC1.12
MISO  (via drill 0.4)
  Top 0.406: 38.86,13.34 36.2,16 v33.78,16 | 38.86,13.34 v41.15,13.34 44.83,13.34 46.23,14.73 48.01,14.73 48.51,15.24 50.16,15.24 50.8,15.88 50.8,20.32 JP1.8 | NRF1.7 38.86,13.84 38.86,13.34
  Bottom 0.406: JP2.1 43.43,8 43.43,12.32 42.42,13.34 v41.15,13.34 | v33.78,16 33.78,17.53 34.04,17.78 IC1.16
MOSI  (via drill 0.4)
  Top 0.406: NRF1.6 37.47,10.16 39.37,10.16 40.13,9.4 JP2.4 | JP1.6 44.58,14.1 40.64,14.1 39.37,15.37 38.23,15.37 36.7,16.89 v34.67,16.89
  Bottom 0.406: 34.83,16.76 34.83,12.79 NRF1.6 | v34.67,16.89 34.7,16.89 34.83,16.76 | IC1.15 34.83,16.76
N$1
  Bottom 0.406: IC1.7 41.81,20.86 41.91,20.95 | Q1.2 42.55,21.59 41.91,20.95 | C4.1 42.1,20.95 41.91,20.95
N$2
  Bottom 0.406: Q1.1 42.99,16.7 C5.1 41.91,18.03 41.12,18.82 IC1.8
N$3  (via drill 0.4)
  Top 0.406: v29.59,22.61 29.59,19.87 C7.1
  Bottom 0.406: v29.59,22.61 29.72,22.48 32.52,22.48 IC1.20
N$4  (via drill 0.4)
  Top 0.406: LED1.A v40.13,3.94
  Bottom 0.406: v40.13,3.94 40.95,3.11 R3.2
N$5  (via drill 0.4, 0.45)
  Top 0.406: SHUNT.1 4.7,9.27 5.59,10.16 R7.1
  Top 0.813: X4.P$1 7.94,5.27 R22.1
  Top 1.27: v13.34,7.87 12.57,7.11 C13.+ | X4.P$1 8.15,5.48 C13.+ | C13.+ C14.+ 18.77,5.48 v19.68,4.57
  Top 2.54: SHUNT.1 4.7,4.32 4.19,3.81 4.45,3.56 X4.P$1
  Bottom 1.27: IC2.3 13.31,7.85 v13.34,7.87 | IC3.3 20.88,4.57 v19.68,4.57
N$6  (via drill 0.4)
  Top 0.406: v13.34,26.92 IC4.12
  Bottom 0.406: v13.34,26.92 13.34,27.3 11.88,28.76 R12.1 R11.2
N$7  (via drill 0.4)
  Top 0.406: v14.61,23.88 IC4.4 14.61,19.68 16.26,18.03 16.26,16 15.39,16 C16.+ 14.52,16.26 v14.52,14.95 | v11.3,8.13 R22.2
  Bottom 0.406: v14.61,23.88 14.61,23.5 14.86,23.24 17.78,23.24 18.16,23.62 C21.1 | v14.52,14.95 11.3,11.73 v11.3,8.13
N$8
  Top 0.406: SHUNT.2 4.7,11.94 5.46,11.18 6.6,11.18 7.62,12.19 R5.1
  Top 2.54: SHUNT.2 4.7,17.27 4.19,17.78 6.73,17.78 6.73,17.27 X2.P$1
N$9  (via drill 0.4)
  Top 0.406: v12.06,26.92 IC4.13 12.06,29.4 R10.1
  Bottom 0.406: R9.2 10.47,26.92 v12.06,26.92
N$10
  Top 0.406: IC4.9 IC4.8 18.6,28.2 R6.1
N$11
  Top 1.016: 25.27,26.92 29.08,26.92 29.08,28.19 26.54,28.19 26.54,29.46 30.35,29.46 | 30.35,29.46 30.35,25.65 25.27,25.65 25.27,26.92 | 25.27,26.92 25.27,30.73 30.35,30.73 30.35,29.46
N$12
  Top 0.406: IC4.6 17.14,21.02 R8.1 17.08,20.07 18.41,18.73 18.41,14.99 16.51,13.08 13.27,13.08 10.35,10.16 R7.2
N$13  (3 unrouted)
  Top 1.016: 23.37,26.29 24,26.29 | 23.37,27.56 24,27.56 | 23.37,28.83 24,28.83 | 23.37,30.1 24,30.1
N$14  (3 unrouted)
  Top 1.016: 31.62,26.29 32.26,26.29 | 31.62,27.56 32.26,27.56 | 31.62,28.83 32.26,28.83 | 31.62,30.1 32.26,30.1
N$18  (via drill 0.4)
  Top 0.406: IC4.14 10.15,28.2 9.72,28.64 R10.2 10.16,30.29 10.16,30.73 10.16,31.24 10.29,31.37 v15.88,31.37
  Bottom 0.406: v15.88,31.37 15.88,29.78 R18.1
N$19  (via drill 0.4)
  Top 0.406: IC4.3 v13.34,23.88
  Bottom 0.406: R14.2 9.71,25.47 10.03,25.15 12.7,25.15 13.34,24.51 v13.34,23.88 13.34,23.5 11.94,22.1 10.22,22.1 R13.1
N$20  (via drill 0.4)
  Top 0.406: R15.1 12.38,21.27 12.06,21.59 IC4.2 v12.06,23.88
  Bottom 0.406: R16.2 9.97,23.88 v12.06,23.88
N$21  (via drill 0.4)
  Top 0.406: IC4.1 10.79,21.27 R15.2 10.48,20.51 11.43,19.56 v13.08,19.56
  Bottom 0.406: R17.1 13.08,20.89 v13.08,19.56
N$22
  Bottom 0.406: X5.P$4 R11.1
N$23
  Bottom 0.406: X5.P$3 7.3,27.18 R9.1 R14.1
N$24
  Bottom 0.406: R16.1 7.81,23.94 7.62,24.13 5.59,24.13 X5.P$2 1.97,24.64 R19.1
N$32  (via drill 0.4)
  Top 0.406: R23.1 R4.2 15.88,29.65 IC4.10 15.88,26.27 v14.61,25
  Bottom 0.406: v14.61,25 14.62,25 14.73,24.89 15.75,24.89 16.13,24.51 C12.1
N$33
  Top 0.406: R6.2 16.45,24.45 15.88,23.88 IC4.5 15.88,21.96 15.62,21.71 15.62,19.81 17.53,17.91 17.53,15.37 16.13,13.97 12,13.97 10.22,12.19 R5.2
N$$$  (via drill 0.4)
  Top 0.406: IC4.7 18.41,21.97 18.98,21.4 R24.1 19.49,21.46 v20.32,21.46
  Bottom 0.406: v20.32,21.46 19.49,21.46 R24.1
RST  (via drill 0.4)
  Top 0.406: S1.2 49.61,12.7 54.23,12.7 56.13,14.61 57.53,14.61 58.55,15.62 v58.55,20.07
  Bottom 0.406: JP2.5 45.7,11.94 S1.2 S1.1 47.1,3.7 | R2.2 46.52,3.11 47.1,3.7 | C6.2 49.58,3.7 47.1,3.7 | IC1.29 37.23,28.09 38.99,29.84 49.66,29.84 54.48,25.02 54.48,20.45 54.99,19.94 58.55,19.94 v58.55,20.07
RXD  (via drill 0.4)
  Top 0.406: v41.27,28.07 39.21,26 v37.98,26
  Bottom 0.406: JP1.9 52.07,24.89 50.67,26.29 50.67,26.3 49.03,27.94 41.4,27.94 v41.27,28.07 | v37.98,26 38.03,26.05 IC1.30
SCK  (via drill 0.4)
  Top 0.406: 32.51,17.53 32.51,15.11 34.8,12.83 37.34,12.83 NRF1.5 39.88,11.43 40.64,10.67 43.31,10.67 JP2.3 | 32.51,17.53 32.51,17.78 | JP1.10 48.26,22.86 48.26,19.05 44.07,14.86 40.77,14.86 39.62,16 38.61,16 36.83,17.78 32.51,17.78 | 32.51,17.53 v32.26,17.53 32.51,17.78
  Bottom 0.406: v32.26,17.53 32.26,19.78 IC1.17
SCL  (via drill 0.4)
  Top 0.406: R21.2 56.52,19.3 56.26,19.56 52.58,19.56 JP1.5 | v44.96,25.91 44.96,25.53 44.58,25.15 v36.45,25.15
  Bottom 0.406: MPU1.SCL 59.44,17.53 53.59,17.53 JP1.5 50.8,20.32 48.77,20.32 47.5,21.59 47.5,22.86 44.96,25.4 v44.96,25.91 | v36.45,25.15 36.45,27.13 IC1.28
SDA  (via drill 0.4)
  Top 0.406: R20.2 54.3,17.78 53.34,17.78 JP1.3 | v35.56,24.26 43.94,24.26 v44.07,24.38
  Bottom 0.406: MPU1.SDA JP1.3 50.8,17.78 48.77,17.78 46.86,19.68 46.86,21.97 44.45,24.38 v44.07,24.38 | v35.56,24.26 35.56,27.08 IC1.27
TXD
  Bottom 0.406: IC1.31 38.83,26.19 39.12,25.91 39.88,25.91 41.02,27.05 48.51,27.05 50.8,24.77 50.8,22.86 JP1.7
V+
  Top 0.61: 66.93,16.38 66.67,16.64 66.67,17.02 65.15,18.54 J8.1
  Top 1.27: 67.59,9.4 C31.+ 67.06,16.26 66.93,16.38 66.93,16 67.44,15.49 67.46,15.52 C30.+ 69.34,16.64 69.6,16.89 69.6,17.91 69.47,18.03 69.95,18.03 C33.+ | 67.59,9.4 71.5,9.4 71.63,9.53 C32.+ | C34.+ 65.13,8.74 65.79,9.4 67.59,9.4
  Bottom 0.406: 64.77,25.15 64.77,28.07
  Bottom 1.016: 64.77,28.07 64.77,29.08 64.64,29.21
  Bottom 1.27: 64.77,25.15 64.77,18.67 J8.1
  Bottom 2: J7.2 J6.2 J5.2 64.64,29.21 J4.2 J3.2 J2.2 J1.2
VOLTAGE_CELL1  (via drill 0.4)
  Top 0.406: v1.91,21.21 3.56,21.21 4.95,19.81 9.91,19.81 11.9,17.82 v14.86,17.82
  Bottom 0.406: R19.2 v1.91,21.21 | v14.86,17.82 13.55,17.82 13.46,17.91 13.4,17.84 C18.1 13.7,17.1 D2.C 19.94,15.75 25.78,21.59 32.47,21.59 IC1.19
VOLTAGE_CELL2
  Bottom 0.406: R17.2 14.92,21.91 15.37,22.35 19.49,22.35 C19.1 20.49,22.75 D3.C 22.33,23.11 26.54,23.11 28.29,24.86 IC1.23
VOLTAGE_CELL3
  Bottom 0.406: R18.2 18.67,29.72 18.92,29.46 19.81,29.46 20.19,29.08 C20.1 20.49,29.32 D4.C 22.5,29.32 26.16,25.66 IC1.24

### Text on the board
tNames: + | receevur | v2 | github.com/stonetronics/stoneaero | 07.11.19 | - | NRF24L01+PA+LNA | MPU9250